# Altium project STM32unit.PrjPcb
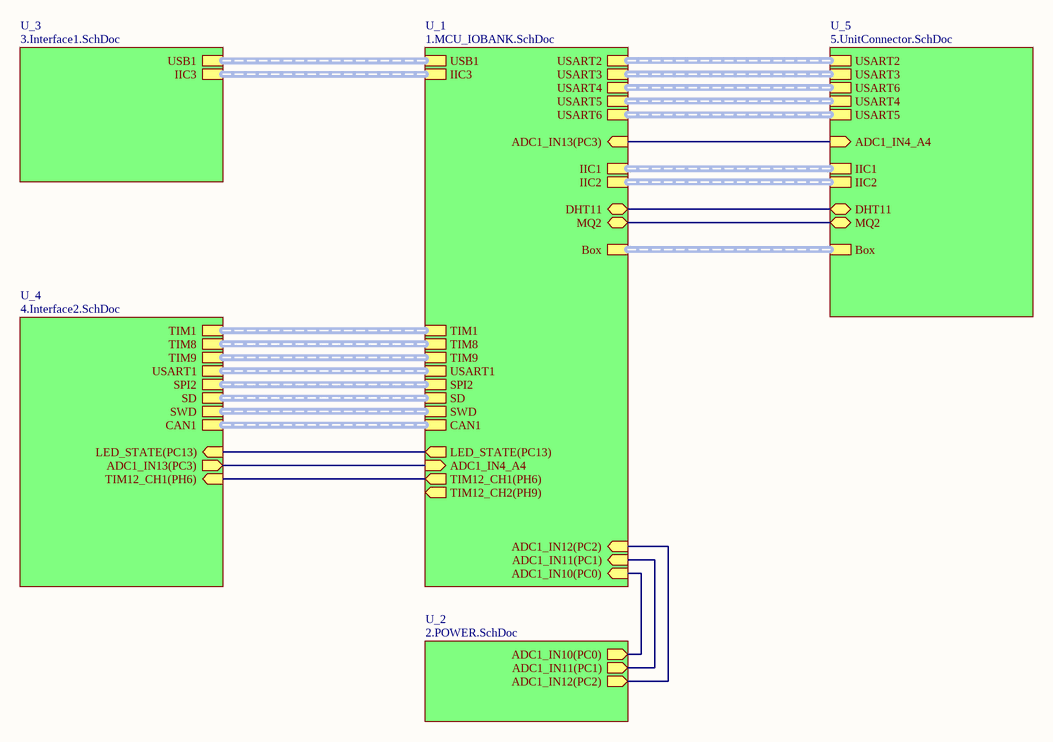
[diagram p0: SCH_Connect.SchDoc]
6 sheets, 230 parts. Net scope: hierarchical (ports join the sheet entries above them; power ports are global).
Board file: STM32unitV1.PcbDoc
Sheets:
  SCH_Connect.SchDoc
    U_1 = 1.MCU_IOBANK.SchDoc
    U_2 = 2.POWER.SchDoc
    U_3 = 3.Interface1.SchDoc
    U_4 = 4.Interface2.SchDoc
    U_5 = 5.UnitConnector.SchDoc

## Sheet SCH_Connect.SchDoc
size A4; DocumentNumber: 1; SheetNumber: 1; SheetTotal: 6

### Sub-sheets
U_1 = 1.MCU_IOBANK.SchDoc: TIM12_CH1(PH6) (out), TIM12_CH2(PH9) (out), LED_STATE(PC13) (out), ADC1_IN10(PC0) (in), ADC1_IN11(PC1) (in), ADC1_IN12(PC2) (in), ADC1_IN13(PC3) (in), TIM1 (harness TIM1), TIM8 (harness TIM8), USART1 (harness USART1), TIM9 (harness TIM9), SPI2 (harness SPI2), SD (harness SD), USART2 (harness USART2), USART3 (harness USART3), USART6 (harness USART6), SWD (harness SWD), CAN1 (harness CAN1), USB1 (harness USB1), ADC1_IN4_A4 (in), USART4 (harness USART4), USART5 (harness USART5), IIC1 (harness IIC1), IIC2 (harness IIC2), DHT11 (bidir), MQ2 (bidir), IIC3 (harness IIC3), Box (harness Box)
U_2 = 2.POWER.SchDoc: ADC1_IN10(PC0) (out), ADC1_IN11(PC1) (out), ADC1_IN12(PC2) (out)
U_3 = 3.Interface1.SchDoc: USB1 (harness USB1), IIC3 (harness IIC3)
U_4 = 4.Interface2.SchDoc: TIM12_CH1(PH6) (in), ADC1_IN13(PC3) (out), TIM1 (harness TIM1), TIM8 (harness TIM8), USART1 (harness USART1), TIM9 (harness TIM9), SPI2 (harness SPI2), LED_STATE(PC13) (in), SD (harness SD), SWD (harness SWD), CAN1 (harness CAN1)
U_5 = 5.UnitConnector.SchDoc: USART2 (harness USART2), USART3 (harness USART3), USART6 (harness USART6), ADC1_IN4_A4 (in), USART4 (harness USART4), USART5 (harness USART5), IIC1 (harness IIC1), IIC2 (harness IIC2), DHT11 (bidir), MQ2 (bidir), Box (harness Box)

### Nets
PA4: sheet U_1/ADC1_IN4_A4, sheet U_4/ADC1_IN13(PC3)
PC0: sheet U_1/ADC1_IN10(PC0), sheet U_2/ADC1_IN10(PC0)
PC1: sheet U_1/ADC1_IN11(PC1), sheet U_2/ADC1_IN11(PC1)
PC2: sheet U_1/ADC1_IN12(PC2), sheet U_2/ADC1_IN12(PC2)
PC3: sheet U_1/ADC1_IN13(PC3), sheet U_5/ADC1_IN4_A4
PC4: sheet U_1/DHT11, sheet U_5/DHT11
PC5: sheet U_1/MQ2, sheet U_5/MQ2
PC13: sheet U_1/LED_STATE(PC13), sheet U_4/LED_STATE(PC13)
PH6: sheet U_1/TIM12_CH1(PH6), sheet U_4/TIM12_CH1(PH6)

### Buses and harness runs
harness sheet U_1/Box = sheet U_5/Box
harness sheet U_1/CAN1 = sheet U_4/CAN1
harness sheet U_1/IIC1 = sheet U_5/IIC1
harness sheet U_1/IIC2 = sheet U_5/IIC2
harness sheet U_1/IIC3 = sheet U_3/IIC3
harness sheet U_1/SD = sheet U_4/SD
harness sheet U_1/SPI2 = sheet U_4/SPI2
harness sheet U_1/SWD = sheet U_4/SWD
harness sheet U_1/TIM1 = sheet U_4/TIM1
harness sheet U_1/TIM8 = sheet U_4/TIM8
harness sheet U_1/TIM9 = sheet U_4/TIM9
harness sheet U_1/USART1 = sheet U_4/USART1
harness sheet U_1/USART2 = sheet U_5/USART2
harness sheet U_1/USART3 = sheet U_5/USART3
harness sheet U_1/USART4 = sheet U_5/USART6
harness sheet U_1/USART5 = sheet U_5/USART4
harness sheet U_1/USART6 = sheet U_5/USART5
harness sheet U_1/USB1 = sheet U_3/USB1

## Sheet 1.MCU_IOBANK.SchDoc
size A3; DocumentNumber: 2; SheetNumber: 2; SheetTotal: 6
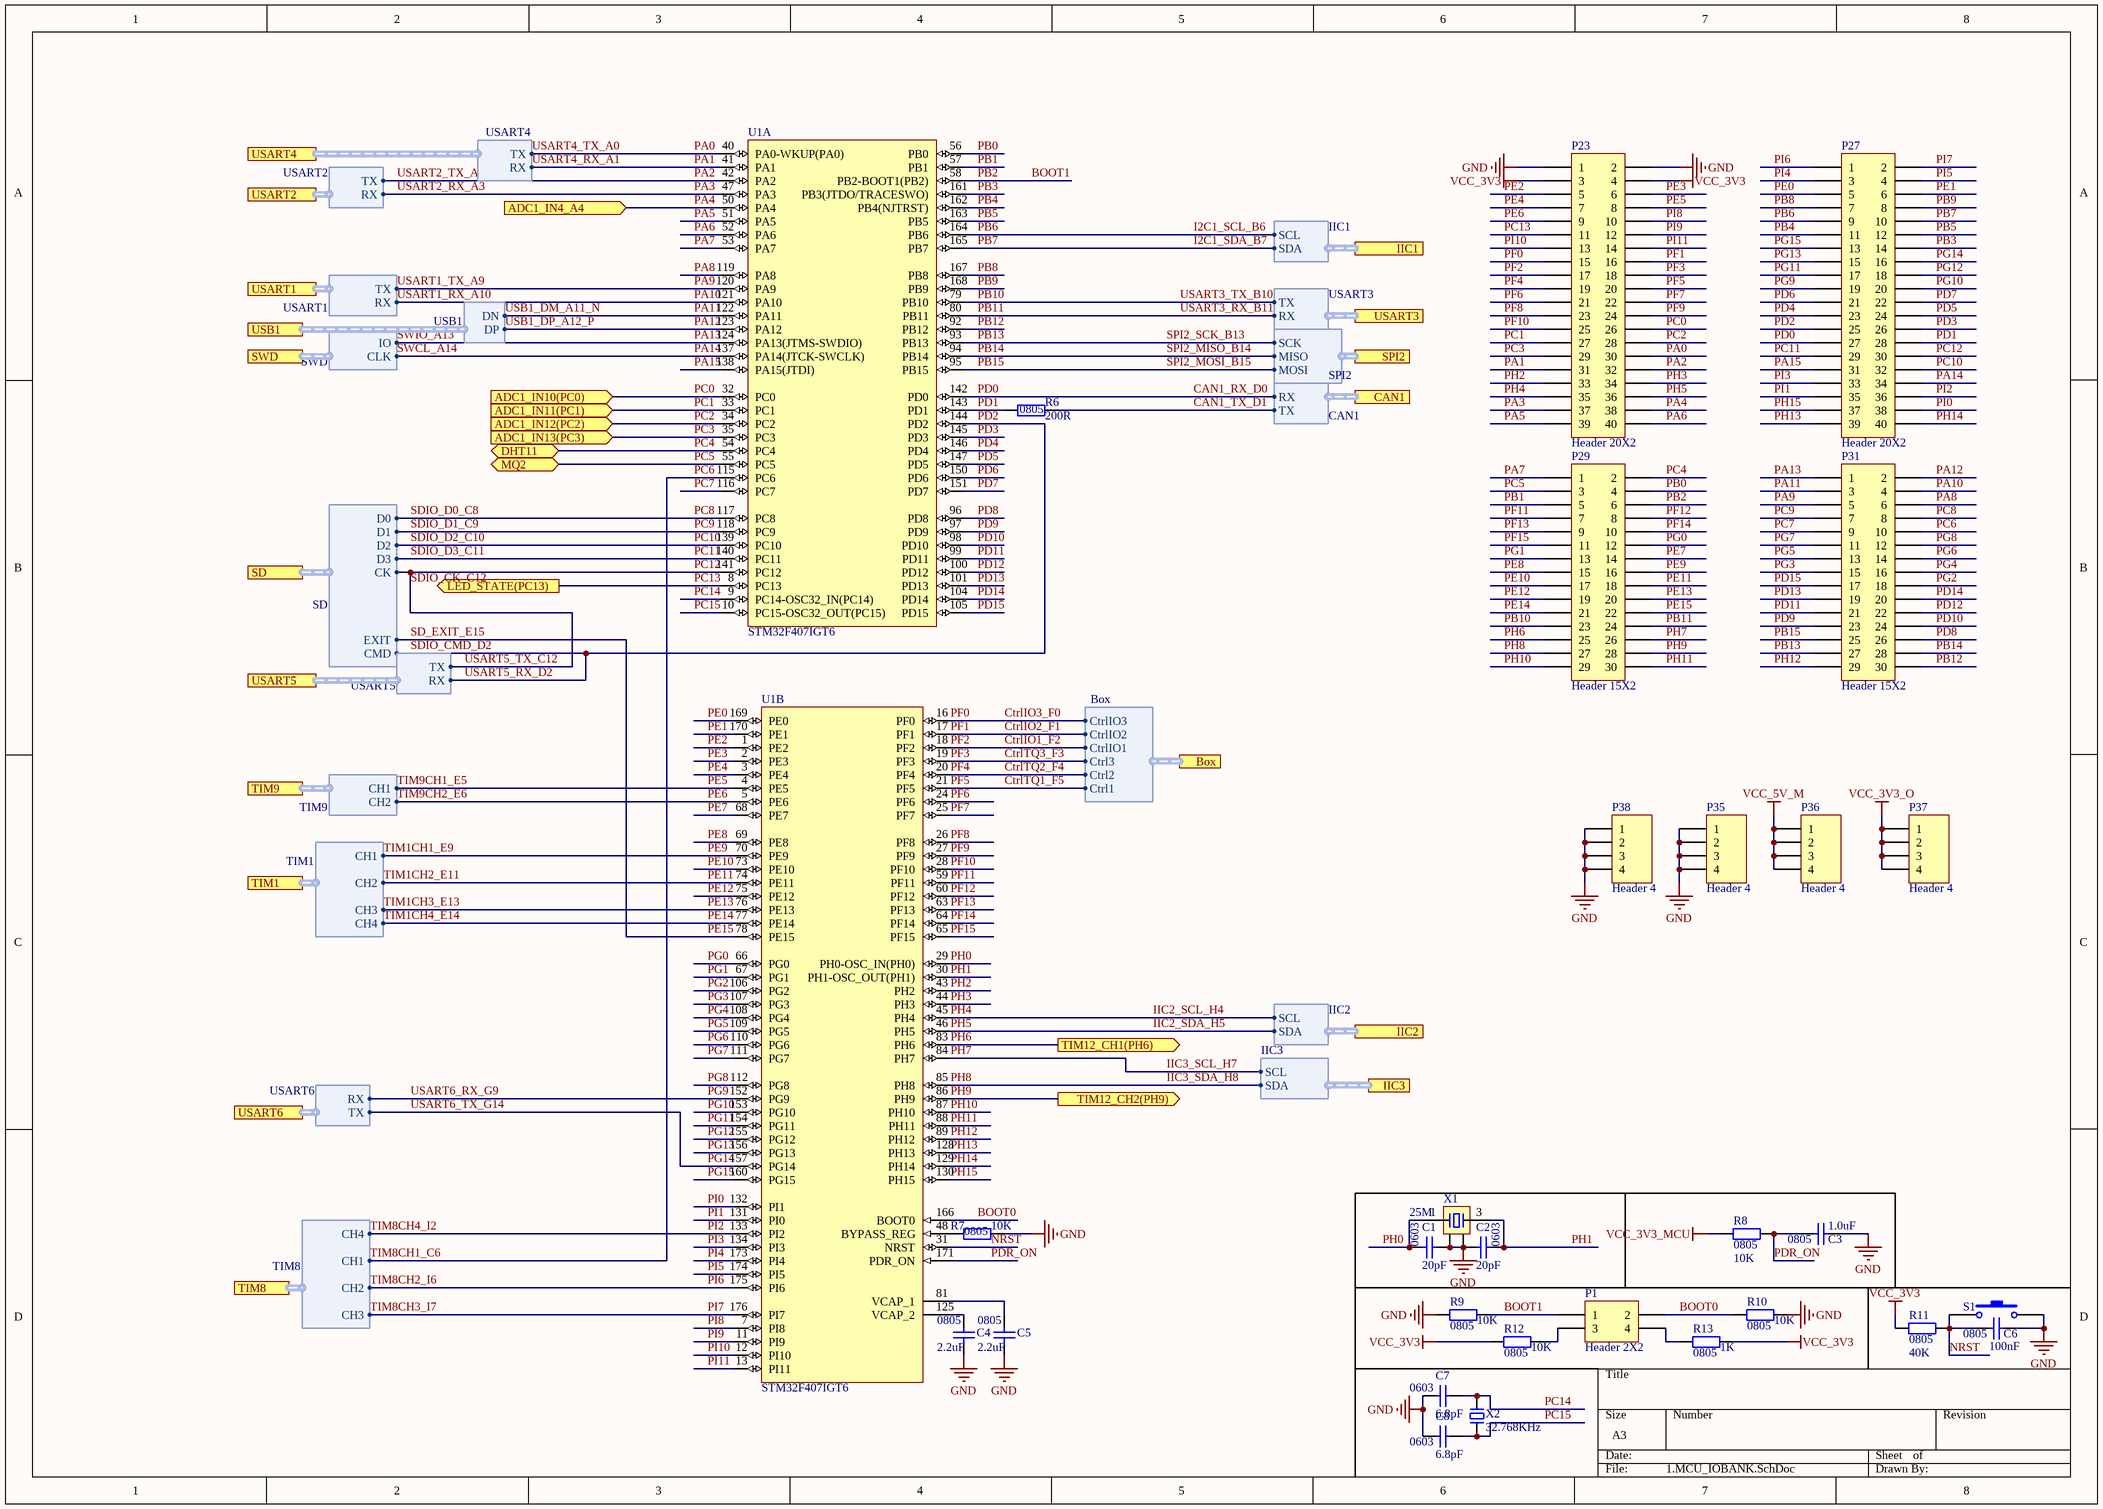
[diagram p1: 1.MCU_IOBANK.SchDoc]

### Parts
C1  0603  value 20pF  [C 0603_L]
C2  0603  value 20pF  [C 0603_L]
C3  0805  value 1.0uF  [C 0805_M]
C4  0805  value 2.2uF  [C 0805_M]
C5  0805  value 2.2uF  [C 0805_M]
C6  0805  value 100nF  [C 0805_M]
C7  0603  value 6.8pF  [C 0603_M]
C8  0603  value 6.8pF  [C 0603_L]
P1  Header 2X2  [HDR2.54-LI-2x2P]
P23  Header 20X2  [HDR2X20]
P27  Header 20X2  [HDR2X20]
P29  Header 15X2  [HDR2X15]
P31  Header 15X2  [HDR2X15]
P35  Header 4  [HDR2.54-LI-4P]
P36  Header 4  [HDR2.54-LI-4P]
P37  Header 4  [HDR2.54-LI-4P]
P38  Header 4  [HDR2.54-LI-4P]
R6  0805  value 200R  [R 0805_L]
R7  0805  value 10K  [R 0805_L]
R8  0805  value 10K  [R 0805_L]
R9  0805  value 10K  [R 0805_L]
R10  0805  value 10K  [R 0805_L]
R11  0805  value 40K  [R 0805_L]
R12  0805  value 10K  [R 0805_L]
R13  0805  value 1K  [R 0805_L]
S1  SW  [TSW DIP-3*6*5]  (value not drawn)
U1  STM32F407IGT6  [STM-LQFP176_N]  (parts A,B of 3)
X1  25M  [XTAL-3225]
X2  32.768KHz  [XTAL-3215A]

### Ports
ADC1_IN4_A4 (in), ADC1_IN10(PC0) (in), ADC1_IN11(PC1) (in), ADC1_IN12(PC2) (in), ADC1_IN13(PC3) (in), Box (harness Box), CAN1 (harness CAN1), DHT11 (bidir), IIC1 (harness IIC1), IIC2 (harness IIC2), IIC3 (harness IIC3), LED_STATE(PC13) (out), MQ2 (bidir), SD (harness SD), SPI2 (harness SPI2), SWD (harness SWD), TIM1 (harness TIM1), TIM8 (harness TIM8), TIM9 (harness TIM9), TIM12_CH1(PH6) (out), TIM12_CH2(PH9) (out), USART1 (harness USART1), USART2 (harness USART2), USART3 (harness USART3), USART4 (harness USART4), USART5 (harness USART5), USART6 (harness USART6), USB1 (harness USB1)

### Harnesses
TIM1: CH1, CH2, CH3, CH4
TIM8: CH1, CH2, CH3, CH4
USART1: RX, TX
TIM9: CH1, CH2
SPI2: MOSI, MISO, SCK
SD: EXIT, D1, D0, CK, CMD, D3, D2
USART2: TX, RX
USART3: RX, TX
USART6: TX, RX
SWD: IO, CLK
CAN1: TX, RX
USB1: DN, DP
USART4: TX, RX
USART5: TX, RX
IIC1: SCL, SDA
IIC2: SCL, SDA
IIC3: SDA, SCL
Box: Ctrl1, Ctrl2, Ctrl3, CtrlIO1, CtrlIO2, CtrlIO3

### Nets
GND: C1.2 C2.1 C3.1 C4.1 C5.1 C6.1 C7.1 C8.1 P23.1 P23.2 P35.1 P35.2 P35.3 P35.4 P38.1 P38.2 P38.3 P38.4 R7.2 R9.1 R10.2 S1.2 X1.2 X1.4
VCC_3V3: P23.3 P23.4 R11.1 R12.1 R13.2  [project net +3.3V]
VCC_3V3_MCU: R8.1
VCC_3V3_O: P37.1 P37.2 P37.3 P37.4
VCC_5V_M: P36.1 P36.2 P36.3 P36.4
BOOT0: P1.2 R10.1 U1.166(BOOT0)
BOOT1: P1.1 P29.6 R9.2 U1.58(PB2-BOOT1(PB2))  [also labelled PB2]
CAN1_RX_D0: P27.27 U1.142(PD0) ; port CAN1.RX  [also labelled PD0]
CAN1_TX_D1: R6.2 ; port CAN1.TX
CtrlIO1_F2: P23.17 U1.18(PF2) ; port Box.CtrlIO1  [also labelled PF2]
CtrlIO2_F1: P23.16 U1.17(PF1) ; port Box.CtrlIO2  [also labelled PF1]
CtrlIO3_F0: P23.15 U1.16(PF0) ; port Box.CtrlIO3  [also labelled PF0]
CtrlTQ1_F5: P23.20 U1.21(PF5) ; port Box.Ctrl1  [also labelled PF5]
CtrlTQ2_F4: P23.19 U1.20(PF4) ; port Box.Ctrl2  [also labelled PF4]
CtrlTQ3_F3: P23.18 U1.19(PF3) ; port Box.Ctrl3  [also labelled PF3]
I2C1_SCL_B6: P27.9 U1.164(PB6) ; port IIC1.SCL  [also labelled PB6]
I2C1_SDA_B7: P27.10 U1.165(PB7) ; port IIC1.SDA  [also labelled PB7]
IIC2_SCL_H4: P23.35 U1.45(PH4) ; port IIC2.SCL  [also labelled PH4]
IIC2_SDA_H5: P23.36 U1.46(PH5) ; port IIC2.SDA  [also labelled PH5]
IIC3_SCL_H7: P29.26 U1.84(PH7) ; port IIC3.SCL  [also labelled PH7]
IIC3_SDA_H8: P29.27 U1.85(PH8) ; port IIC3.SDA  [also labelled PH8]
NRST: C6.2 R11.2 S1.1 U1.31(NRST)
PA0: P23.30 U1.40(PA0-WKUP(PA0)) ; port USART4.TX  [also labelled USART4_TX_A0]
PA1: P23.31 U1.41(PA1) ; port USART4.RX  [also labelled USART4_RX_A1]
PA2: P23.32 U1.42(PA2) ; port USART2.TX  [also labelled USART2_TX_A2]
PA3: P23.37 U1.47(PA3) ; port USART2.RX  [also labelled USART2_RX_A3]
PA4: P23.38 U1.50(PA4) ; port ADC1_IN4_A4
PA5: P23.39 U1.51(PA5)
PA6: P23.40 U1.52(PA6)
PA7: P29.1 U1.53(PA7)
PA8: P31.6 U1.119(PA8)
PA9: P31.5 U1.120(PA9) ; port USART1.TX  [also labelled USART1_TX_A9]
PA10: P31.4 U1.121(PA10) ; port USART1.RX  [also labelled USART1_RX_A10]
PA11: P31.3 U1.122(PA11) ; port USB1.DN  [also labelled USB1_DM_A11_N]
PA12: P31.2 U1.123(PA12) ; port USB1.DP  [also labelled USB1_DP_A12_P]
PA13: P31.1 U1.124(PA13(JTMS-SWDIO)) ; port SWD.IO  [also labelled SWIO_A13]
PA14: P27.34 U1.137(PA14(JTCK-SWCLK)) ; port SWD.CLK  [also labelled SWCL_A14]
PA15: P27.31 U1.138(PA15(JTDI))
PB0: P29.4 U1.56(PB0)
PB1: P29.5 U1.57(PB1)
PB3: P27.14 U1.161(PB3(JTDO/TRACESWO))
PB4: P27.11 U1.162(PB4(NJTRST))
PB5: P27.12 U1.163(PB5)
PB8: P27.7 U1.167(PB8)
PB9: P27.8 U1.168(PB9)
PB10: P29.23 U1.79(PB10) ; port USART3.TX  [also labelled USART3_TX_B10]
PB11: P29.24 U1.80(PB11) ; port USART3.RX  [also labelled USART3_RX_B11]
PB12: P31.30 U1.92(PB12)
PB13: P31.27 U1.93(PB13) ; port SPI2.SCK  [also labelled SPI2_SCK_B13]
PB14: P31.28 U1.94(PB14) ; port SPI2.MISO  [also labelled SPI2_MISO_B14]
PB15: P31.25 U1.95(PB15) ; port SPI2.MOSI  [also labelled SPI2_MOSI_B15]
PC0: P23.26 U1.32(PC0) ; port ADC1_IN10(PC0)
PC1: P23.27 U1.33(PC1) ; port ADC1_IN11(PC1)
PC2: P23.28 U1.34(PC2) ; port ADC1_IN12(PC2)
PC3: P23.29 U1.35(PC3) ; port ADC1_IN13(PC3)
PC4: P29.2 U1.54(PC4) ; port DHT11
PC5: P29.3 U1.55(PC5) ; port MQ2
PC6: P31.10 U1.115(PC6) ; port TIM8.CH1  [also labelled TIM8CH1_C6]
PC7: P31.9 U1.116(PC7)
PC8: P31.8 U1.117(PC8) ; port SD.D0  [also labelled SDIO_D0_C8]
PC9: P31.7 U1.118(PC9) ; port SD.D1  [also labelled SDIO_D1_C9]
PC10: P27.32 U1.139(PC10) ; port SD.D2  [also labelled SDIO_D2_C10]
PC11: P27.29 U1.140(PC11) ; port SD.D3  [also labelled SDIO_D3_C11]
PC12: P27.30 U1.141(PC12) ; port SD.CK, port USART5.TX  [also labelled SDIO_CK_C12, USART5_TX_C12]
PC13: P23.11 U1.8(PC13) ; port LED_STATE(PC13)
PC14: C7.2 U1.9(PC14-OSC32_IN(PC14)) X2.2
PC15: C8.2 U1.10(PC15-OSC32_OUT(PC15)) X2.1
PD1: P27.28 R6.1 U1.143(PD1)
PD2: P27.25 U1.144(PD2) ; port SD.CMD, port USART5.RX  [also labelled SDIO_CMD_D2, USART5_RX_D2]
PD3: P27.26 U1.145(PD3)
PD4: P27.23 U1.146(PD4)
PD5: P27.24 U1.147(PD5)
PD6: P27.21 U1.150(PD6)
PD7: P27.22 U1.151(PD7)
PD8: P31.26 U1.96(PD8)
PD9: P31.23 U1.97(PD9)
PD10: P31.24 U1.98(PD10)
PD11: P31.21 U1.99(PD11)
PD12: P31.22 U1.100(PD12)
PD13: P31.19 U1.101(PD13)
PD14: P31.20 U1.104(PD14)
PD15: P31.17 U1.105(PD15)
PDR_ON: C3.2 R8.2 U1.171(PDR_ON)
PE0: P27.5 U1.169(PE0)
PE1: P27.6 U1.170(PE1)
PE2: P23.5 U1.1(PE2)
PE3: P23.6 U1.2(PE3)
PE4: P23.7 U1.3(PE4)
PE5: P23.8 U1.4(PE5) ; port TIM9.CH1  [also labelled TIM9CH1_E5]
PE6: P23.9 U1.5(PE6) ; port TIM9.CH2  [also labelled TIM9CH2_E6]
PE7: P29.14 U1.68(PE7)
PE8: P29.15 U1.69(PE8)
PE9: P29.16 U1.70(PE9) ; port TIM1.CH1  [also labelled TIM1CH1_E9]
PE10: P29.17 U1.73(PE10)
PE11: P29.18 U1.74(PE11) ; port TIM1.CH2  [also labelled TIM1CH2_E11]
PE12: P29.19 U1.75(PE12)
PE13: P29.20 U1.76(PE13) ; port TIM1.CH3  [also labelled TIM1CH3_E13]
PE14: P29.21 U1.77(PE14) ; port TIM1.CH4  [also labelled TIM1CH4_E14]
PE15: P29.22 U1.78(PE15) ; port SD.EXIT  [also labelled SD_EXIT_E15]
PF6: P23.21 U1.24(PF6)
PF7: P23.22 U1.25(PF7)
PF8: P23.23 U1.26(PF8)
PF9: P23.24 U1.27(PF9)
PF10: P23.25 U1.28(PF10)
PF11: P29.7 U1.59(PF11)
PF12: P29.8 U1.60(PF12)
PF13: P29.9 U1.63(PF13)
PF14: P29.10 U1.64(PF14)
PF15: P29.11 U1.65(PF15)
PG0: P29.12 U1.66(PG0)
PG1: P29.13 U1.67(PG1)
PG2: P31.18 U1.106(PG2)
PG3: P31.15 U1.107(PG3)
PG4: P31.16 U1.108(PG4)
PG5: P31.13 U1.109(PG5)
PG6: P31.14 U1.110(PG6)
PG7: P31.11 U1.111(PG7)
PG8: P31.12 U1.112(PG8)
PG9: P27.19 U1.152(PG9) ; port USART6.RX  [also labelled USART6_RX_G9]
PG10: P27.20 U1.153(PG10)
PG11: P27.17 U1.154(PG11)
PG12: P27.18 U1.155(PG12)
PG13: P27.15 U1.156(PG13)
PG14: P27.16 U1.157(PG14) ; port USART6.TX  [also labelled USART6_TX_G14]
PG15: P27.13 U1.160(PG15)
PH0: C1.1 U1.29(PH0-OSC_IN(PH0)) X1.1
PH1: C2.2 U1.30(PH1-OSC_OUT(PH1)) X1.3
PH2: P23.33 U1.43(PH2)
PH3: P23.34 U1.44(PH3)
PH6: P29.25 U1.83(PH6) ; port TIM12_CH1(PH6)
PH9: P29.28 U1.86(PH9) ; port TIM12_CH2(PH9)
PH10: P29.29 U1.87(PH10)
PH11: P29.30 U1.88(PH11)
PH12: P31.29 U1.89(PH12)
PH13: P27.39 U1.128(PH13)
PH14: P27.40 U1.129(PH14)
PH15: P27.37 U1.130(PH15)
PI0: P27.38 U1.132(PI1)
PI1: P27.35 U1.131(PI0)
PI2: P27.36 U1.133(PI2) ; port TIM8.CH4  [also labelled TIM8CH4_I2]
PI3: P27.33 U1.134(PI3)
PI4: P27.3 U1.173(PI4)
PI5: P27.4 U1.174(PI5)
PI6: P27.1 U1.175(PI6) ; port TIM8.CH2  [also labelled TIM8CH2_I6]
PI7: P27.2 U1.176(PI7) ; port TIM8.CH3  [also labelled TIM8CH3_I7]
PI8: P23.10 U1.7(PI8)
PI9: P23.12 U1.11(PI9)
PI10: P23.13 U1.12(PI10)
PI11: P23.14 U1.13(PI11)
NetC4_2: C4.2 U1.125(VCAP_2)
NetC5_2: C5.2 U1.81(VCAP_1)
NetP1_3: P1.3 R12.2
NetP1_4: P1.4 R13.1
NetR7_1: R7.1 U1.48(BYPASS_REG)

### Library data of the parts
C1-C8 = CAP
P1 = Header 2X2: Header, 2-Pin, Dual row; LatestRevisionDate: 17-Jul-2002; LatestRevisionNote: Re-released for DXP Platform.; Publisher: Altium Limited
P23 P27 = Header 20X2: Header, 20-Pin, Dual row; LatestRevisionDate: 17-Jul-2002; LatestRevisionNote: Re-released for DXP Platform.; Publisher: Altium Limited
P29 P31 = Header 15X2: Header, 15-Pin, Dual row; LatestRevisionDate: 17-Jul-2002; LatestRevisionNote: Re-released for DXP Platform.; Publisher: Altium Limited
P35-P38 = Header 4: Header, 4-Pin; LatestRevisionDate: 17-Jul-2002; LatestRevisionNote: Re-released for DXP Platform.; Publisher: Altium Limited
R6-R13 = RES2: Resistor; Published: 8-Jun-2000; LatestRevisionDate: 17-Jul-2002; LatestRevisionNote: Re-released for DXP Platform.; PackageReference: AXIAL-0.3; Publisher: Altium Limited; PackageDescription: Axial Device, Thru-Hole; 2 Leads; 0.3 in Pin Spacing
U1 = STM32F407IGT6: ARM Cortex-M4 32-bit MCU+FPU, 210 DMIPS, 1024 kB Flash, 192 kB Internal RAM, 140 I/Os, 176-pin LQFP, -40 to 85 degC, Tray; Manufacturer: STMicroelectronics; D/A Converter: 2x12-bit; FLASH Size (Prog) (kB): 1024; I/Os (High Current): 140; Internal RAM Size (kB): 192; Operating Frequency(F) (Processor speed) (MHz): 168; Supply Voltage(Vcc) max (V): 3.6; Supply Voltage(Vcc) min (V): 1.8; DatasheetVersion: Rev. 4; PackageVersion: Rev. 4, 06/2013; PackageReference: LQFP176; PackageDescription: 176-Pin Low Profile Quad Flat Package, 24 x 24 mm Body, 0.5 mm Pitch; Supplier 1: Digi-Key; Supplier Part Number 1: 497-11604-ND; Supplier 2: Farnell; Supplier Part Number 2: 2064366; Supplier 3: Newark; Supplier Part Number 3: 73T2331; Supplier 4: Mouser; Supplier Part Number 4: 511-STM32F407IGT6; Core: ARM Cortex-M4; Packing: Tray; Mounting Technology: Surface Mount; PartNumber: STM32F407IGT6; ComponentLink1Description: Manufacturer URL; ComponentLink1URL: http://www.st.com/web/en/home.html; ComponentLink2Description: Datasheet; ComponentLink2URL: http://www.st.com/st-web-ui/static/active/en/resource/technical/document/datasheet/DM00037051.pdf; ComponentLink3Description: Package Specification; ComponentLink3URL: http://www.st.com/st-web-ui/static/active/en/resource/technical/document/datasheet/DM00035129.pdf
X1 = XTAL-4: 4脚晶振; 版权归属: 源创客; BOM名称: 4脚晶振; 学习资源: www.ooocke.com
X2 = XTAL-2: 2脚晶振; 版权归属: 源创客; BOM名称: 2脚晶振; 学习资源: www.ooocke.com
S1 = SW: Published: 24-Mar-1999; LatestRevisionDate: 17-Jul-2002; LatestRevisionNote: Re-released for DXP Platform.; Publisher: Altium Limited

## Sheet 2.POWER.SchDoc
size A4; DocumentNumber: 3; SheetNumber: 3; SheetTotal: 6
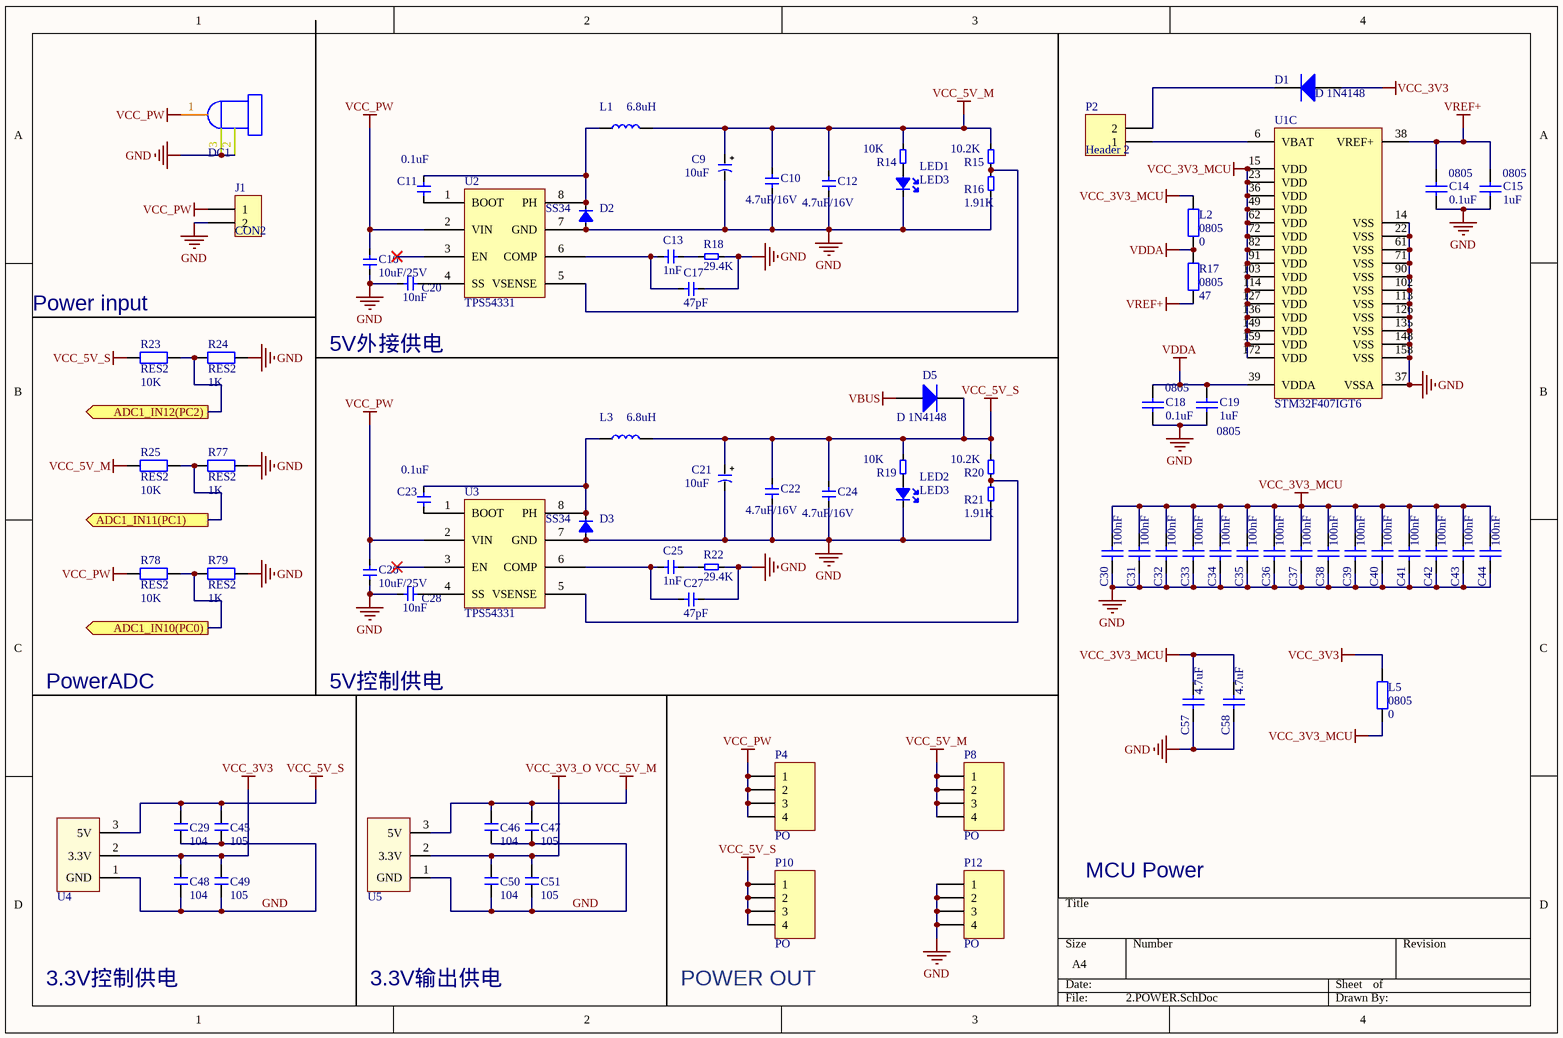
[diagram p2: 2.POWER.SchDoc]

### Parts
C9  10uF  [3528]
C10  4.7uF/16V  [0603C]
C11  0.1uF  [0603C]
C12  4.7uF/16V  [0603C]
C13  1nF  [0603C]
C14  0805  value 0.1uF  [C 0603_L]
C15  0805  value 1uF  [C 0603_L]
C16  10uF/25V  [1206]
C17  47pF  [0603C]
C18  0805  value 0.1uF  [C 0603_L]
C19  0805  value 1uF  [C 0603_L]
C20  10nF  [0603C]
C21  10uF  [3528]
C22  4.7uF/16V  [0603C]
C23  0.1uF  [0603C]
C24  4.7uF/16V  [0603C]
C25  1nF  [0603C]
C26  10uF/25V  [1206]
C27  47pF  [0603C]
C28  10nF  [0603C]
C29  104  [C 0805]
C30  value 100nF  [C 0603_L]  (hidden comment: 0805)
C31  value 100nF  [C 0603_L]  (hidden comment: 0805)
C32  value 100nF  [C 0603_L]  (hidden comment: 0805)
C33  value 100nF  [C 0603_L]  (hidden comment: 0805)
C34  value 100nF  [C 0603_L]  (hidden comment: 0805)
C35  value 100nF  [C 0603_L]  (hidden comment: 0805)
C36  value 100nF  [C 0603_L]  (hidden comment: 0805)
C37  value 100nF  [C 0603_L]  (hidden comment: 0805)
C38  value 100nF  [C 0603_L]  (hidden comment: 0805)
C39  value 100nF  [C 0603_L]  (hidden comment: 0805)
C40  value 100nF  [C 0603_L]  (hidden comment: 0805)
C41  value 100nF  [C 0603_L]  (hidden comment: 0805)
C42  value 100nF  [C 0603_L]  (hidden comment: 0805)
C43  value 100nF  [C 0603_L]  (hidden comment: 0805)
C44  value 100nF  [C 0603_L]  (hidden comment: 0805)
C45  105  [C 0805]
C46  104  [C 0805]
C47  105  [C 0805]
C48  104  [C 0805]
C49  105  [C 0805]
C50  104  [C 0805]
C51  105  [C 0805]
C57  value 4.7uF  [C 0805_M]  (hidden comment: 0805)
C58  value 4.7uF  [C 0805_M]  (hidden comment: 0805)
D1  D 1N4148  [SOD-523]
D2  SS34  [DO-214AC-SMA]
D3  SS34  [DO-214AC-SMA]
D5  D 1N4148  [SOD-123]
DC1  DC  [DC-005]  (value not drawn)
J1  CON2  [DG1282-5.0]
L1  6.8uH  [L100]
L2  0805  value 0  [R 0402_L]
L3  6.8uH  [L100]
L5  0805  value 0  [R 0805_L]
LED1  LED3  [0603-led]
LED2  LED3  [0603-led]
P2  Header 2  [HDR2.54-LI-2P]
P4  PO  [KF2EDGK-2.54-WI-4P]
P8  PO  [KF2EDGK-2.54-WI-4P]
P10  PO  [KF2EDGK-2.54-WI-4P]
P12  PO  [KF2EDGK-2.54-WI-4P]
R14  10K  [0603]
R15  10.2K  [0603]
R16  1.91K  [0603]
R17  0805  value 47  [R 0402_L]
R18  29.4K  [0603]
R19  10K  [0603]
R20  10.2K  [0603]
R21  1.91K  [0603]
R22  29.4K  [0603]
R23  RES2  value 10K  [R 0805_L]
R24  RES2  value 1K  [R 0805_L]
R25  RES2  value 10K  [R 0805_L]
R77  RES2  value 1K  [R 0805_L]
R78  RES2  value 10K  [R 0805_L]
R79  RES2  value 1K  [R 0805_L]
U1  STM32F407IGT6  [STM-LQFP176_N]  (part C of 3)
U2  TPS54331  [SO08]
U3  TPS54331  [SO08]
U4  LM1117  [SOT223]  (value not drawn)
U5  LM1117  [SOT223]  (value not drawn)

### Ports
ADC1_IN10(PC0) (out), ADC1_IN11(PC1) (out), ADC1_IN12(PC2) (out)

### Nets
GND: C9.2 C10.1 C12.1 C14.1 C15.1 C16.1 C17.2 C18.1 C19.1 C20.2 C21.2 C22.1 C24.1 C26.1 C27.2 C28.2 C29.1 C30.1 C31.1 C32.1 C33.1 C34.1 C35.1 C36.1 C37.1 C38.1 C39.1 C40.1 C41.1 C42.1 C43.1 C44.1 C45.2 C46.1 C47.2 C48.1 C49.2 C50.1 C51.2 C57.1 C58.1 D2.1(A) D3.1(A) DC1.2(-) DC1.3(-) J1.2 LED1.2(K) LED2.2(K) P12.1 P12.2 P12.3 P12.4 R16.1 R18.1 R21.1 R22.1 R24.1 R77.1 R79.1 U1.14(VSS) U1.22(VSS) U1.37(VSSA) U1.61(VSS) U1.71(VSS) U1.90(VSS) U1.102(VSS) U1.113(VSS) U1.126(VSS) U1.135(VSS) U1.148(VSS) U1.158(VSS) U2.7(GND) U3.7(GND) U4.1(GND) U5.1(GND)
VBUS: D5.1(A)
VCC_3V3: C48.2 C49.1 D1.1(A) L5.2 U4.2(3.3V)  [project net +3.3V]
VCC_3V3_MCU: C30.2 C31.2 C32.2 C33.2 C34.2 C35.2 C36.2 C37.2 C38.2 C39.2 C40.2 C41.2 C42.2 C43.2 C44.2 C57.2 C58.2 L2.2 L5.1 U1.15(VDD) U1.23(VDD) U1.36(VDD) U1.49(VDD) U1.62(VDD) U1.72(VDD) U1.82(VDD) U1.91(VDD) U1.103(VDD) U1.114(VDD) U1.127(VDD) U1.136(VDD) U1.149(VDD) U1.159(VDD) U1.172(VDD)
VCC_3V3_O: C50.2 C51.1 U5.2(3.3V)
VCC_5V_M: C9.1 C10.2 C12.2 C46.2 C47.1 L1.1 P8.1 P8.2 P8.3 P8.4 R14.2 R15.2 R25.2 U5.3(5V)
VCC_5V_S: C21.1 C22.2 C24.2 C29.2 C45.1 D5.2(K) L3.1 P10.1 P10.2 P10.3 P10.4 R19.2 R20.2 R23.2 U4.3(5V)
VCC_PW: C16.2 C26.2 DC1.1(+) J1.1 P4.1 P4.2 P4.3 P4.4 R78.2 U2.2(VIN) U3.2(VIN)
VDDA: C18.2 C19.2 L2.1 R17.2 U1.39(VDDA)
VREF+: C14.2 C15.2 R17.1 U1.38(VREF+)
PC0: R78.1 R79.2 ; port ADC1_IN10(PC0)
PC1: R25.1 R77.2 ; port ADC1_IN11(PC1)
PC2: R23.1 R24.2 ; port ADC1_IN12(PC2)
NetC11_1: C11.1 U2.1(BOOT)
NetC11_2: C11.2 D2.2(K) L1.2 U2.8(PH)
NetC13_1: C13.1 R18.2
NetC13_2: C13.2 C17.1 U2.6(COMP)
NetC20_1: C20.1 U2.4(SS)
NetC23_1: C23.1 U3.1(BOOT)
NetC23_2: C23.2 D3.2(K) L3.2 U3.8(PH)
NetC25_1: C25.1 R22.2
NetC25_2: C25.2 C27.1 U3.6(COMP)
NetC28_1: C28.1 U3.4(SS)
NetD1_2: D1.2(K) P2.2
NetLED1_1: LED1.1(A) R14.1
NetLED2_1: LED2.1(A) R19.1
NetP2_1: P2.1 U1.6(VBAT)
NetR15_1: R15.1 R16.2 U2.5(VSENSE)
NetR20_1: R20.1 R21.2 U3.5(VSENSE)

Not connected (* = marked no-connect by the designer): U2 3(EN)*; U3 3(EN)*

### Notes on the sheet
- (near R23) Power input
- 5V外接供电
- PowerADC
- 5V控制供电
- MCU Power
- 3.3V控制供电
- 3.3V输出供电
- (near P10) POWER OUT
- (in symbol CAP-+) +

### Library data of the parts
C9 C21 = CAP-+: Capacitor
C10 C12 C16 C17 C20 C22 C24 C26-C28 = CAP1: Capacitor
C11 C13 C23 C25 = CAP1: Capacitor; 类型: 电容
C14 C15 C18 C19 C30-C44 C57 C58 = CAP
C29 C45-C51 = C: 无极性贴片电容; 版权归属: 源创客; BOM名称: 无极性贴片电容; 学习资源: www.ooocke.com
D1 D5 = D 1N4148: High Conductance Fast Diode; Published: 8-Jun-2000; LatestRevisionDate: 17-Jul-2002; LatestRevisionNote: Re-released for DXP Platform.; DatasheetVersion: 1997; PackageReference: DO-35; Publisher: Altium Limited; PackageDescription: Diode, Axial; Body 3.8 x 1.9 mm (LxDia. max), Lead Dia. 0.53 mm (max); Code_JEDEC: DO-204-AH; ComponentLink1Description: Manufacturer Link; ComponentLink1URL: http://www.fairchildsemi.com/; ComponentLink2Description: Datasheet; ComponentLink2URL: http://www.fairchildsemi.com/ds/1N%2F1N4148.pdf
D2 D3 = DIOLED_1: DIODE LED
L1 L3 = INDUCTOR1_1
L2 L5 R17 R23-R25 R77-R79 = RES2: Resistor; Published: 8-Jun-2000; LatestRevisionDate: 17-Jul-2002; LatestRevisionNote: Re-released for DXP Platform.; PackageReference: AXIAL-0.3; Publisher: Altium Limited; PackageDescription: Axial Device, Thru-Hole; 2 Leads; 0.3 in Pin Spacing
LED1 LED2 = CP_DIOLED: DIODE LED
P2 = Header 2: Header, 2-Pin; LatestRevisionDate: 17-Jul-2002; LatestRevisionNote: Re-released for DXP Platform.; Publisher: Altium Limited
P4 P8 P10 P12 = Header 4: Header, 4-Pin; LatestRevisionDate: 17-Jul-2002; LatestRevisionNote: Re-released for DXP Platform.; Publisher: Altium Limited
R14-R16 R18-R22 = RES2
U1 = STM32F407IGT6: as U1 on sheet 1.MCU_IOBANK; DatasheetVersion: Rev. 4; PackageVersion: Rev. 4, 06/2013; PackageReference: LQFP176; PackageDescription: 176-Pin Low Profile Quad Flat Package, 24 x 24 mm Body, 0.5 mm Pitch; Supplier 1: Digi-Key; Supplier Part Number 1: 497-11604-ND; Supplier 2: Farnell; Supplier Part Number 2: 2064366; Supplier 3: Newark; Supplier Part Number 3: 73T2331; Supplier 4: Mouser; Supplier Part Number 4: 511-STM32F407IGT6; Core: ARM Cortex-M4; Packing: Tray; Mounting Technology: Surface Mount; PartNumber: STM32F407IGT6; ComponentLink1Description: Manufacturer URL; ComponentLink1URL: http://www.st.com/web/en/home.html; ComponentLink2Description: Datasheet; ComponentLink2URL: http://www.st.com/st-web-ui/static/active/en/resource/technical/document/datasheet/DM00037051.pdf; ComponentLink3Description: Package Specification; ComponentLink3URL: http://www.st.com/st-web-ui/static/active/en/resource/technical/document/datasheet/DM00035129.pdf

## Sheet 3.Interface1.SchDoc
size A4; DocumentNumber: 4; SheetNumber: 4; SheetTotal: 7
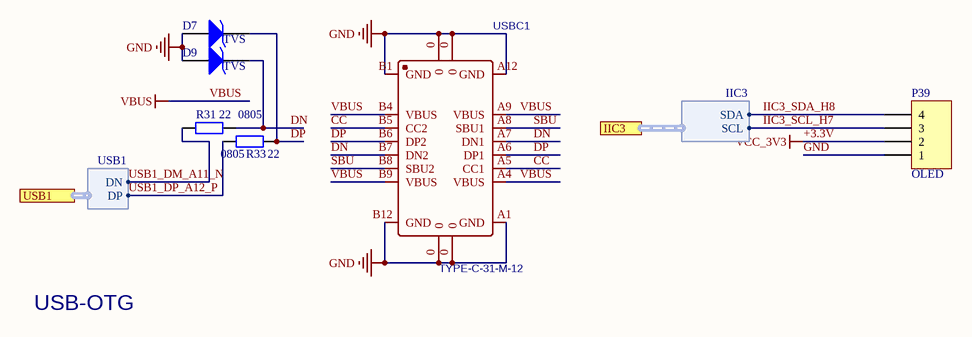
[diagram p3: 3.Interface1.SchDoc]

### Parts
D7  TVS  [SOD-523]
D9  TVS  [SOD-523]
P39  OLED  [HDR1X4]
R31  0805  value 22  [R 0805_L]
R33  0805  value 22  [R 0805_L]
USBC1  TYPE-C-31-M-12  [TYPE-C-USB-17]

### Ports
IIC3 (harness IIC3), USB1 (harness USB1)

### Harnesses
USB1: DN, DP
IIC3: SDA, SCL

### Nets
+3.3V: P39.2  [also labelled VCC_3V3]
GND: D7.1(A) D9.1(A) P39.1 USBC1.0 USBC1.A1(GND) USBC1.A12(GND) USBC1.B1(GND) USBC1.B12(GND)
VBUS: USBC1.A4(VBUS) USBC1.A9(VBUS) USBC1.B4(VBUS) USBC1.B9(VBUS)
CC: USBC1.A5(CC1) USBC1.B5(CC2)
DN: D9.2(K) R31.2 USBC1.A7(DN1) USBC1.B7(DN2)
DP: D7.2(K) R33.2 USBC1.A6(DP1) USBC1.B6(DP2)
IIC3_SCL_H7: P39.3 ; port IIC3.SCL
IIC3_SDA_H8: P39.4 ; port IIC3.SDA
SBU: USBC1.A8(SBU1) USBC1.B8(SBU2)
USB1_DM_A11_N: R31.1 ; port USB1.DN  [project net PA11]
USB1_DP_A12_P: R33.1 ; port USB1.DP  [project net PA12]

### Notes on the sheet
- USB-OTG

### Library data of the parts
D7 D9 = D: High Conductance Fast Diode; Published: 8-Jun-2000; LatestRevisionDate: 17-Jul-2002; LatestRevisionNote: Re-released for DXP Platform.; DatasheetVersion: 1997; PackageReference: DO-35; Publisher: Altium Limited; PackageDescription: Diode, Axial; Body 3.8 x 1.9 mm (LxDia. max), Lead Dia. 0.53 mm (max); Code_JEDEC: DO-204-AH; ComponentLink1Description: Manufacturer Link; ComponentLink1URL: http://www.fairchildsemi.com/; ComponentLink2Description: Datasheet; ComponentLink2URL: http://www.fairchildsemi.com/ds/1N%2F1N4148.pdf
P39 = Header 4: Header, 4-Pin; LatestRevisionDate: 17-Jul-2002; LatestRevisionNote: Re-released for DXP Platform.; Publisher: Altium Limited
R31 R33 = RES2: Resistor; Published: 8-Jun-2000; LatestRevisionDate: 17-Jul-2002; LatestRevisionNote: Re-released for DXP Platform.; PackageReference: AXIAL-0.3; Publisher: Altium Limited; PackageDescription: Axial Device, Thru-Hole; 2 Leads; 0.3 in Pin Spacing

## Sheet 4.Interface2.SchDoc
size A4; DocumentNumber: 5; SheetNumber: 5; SheetTotal: 6
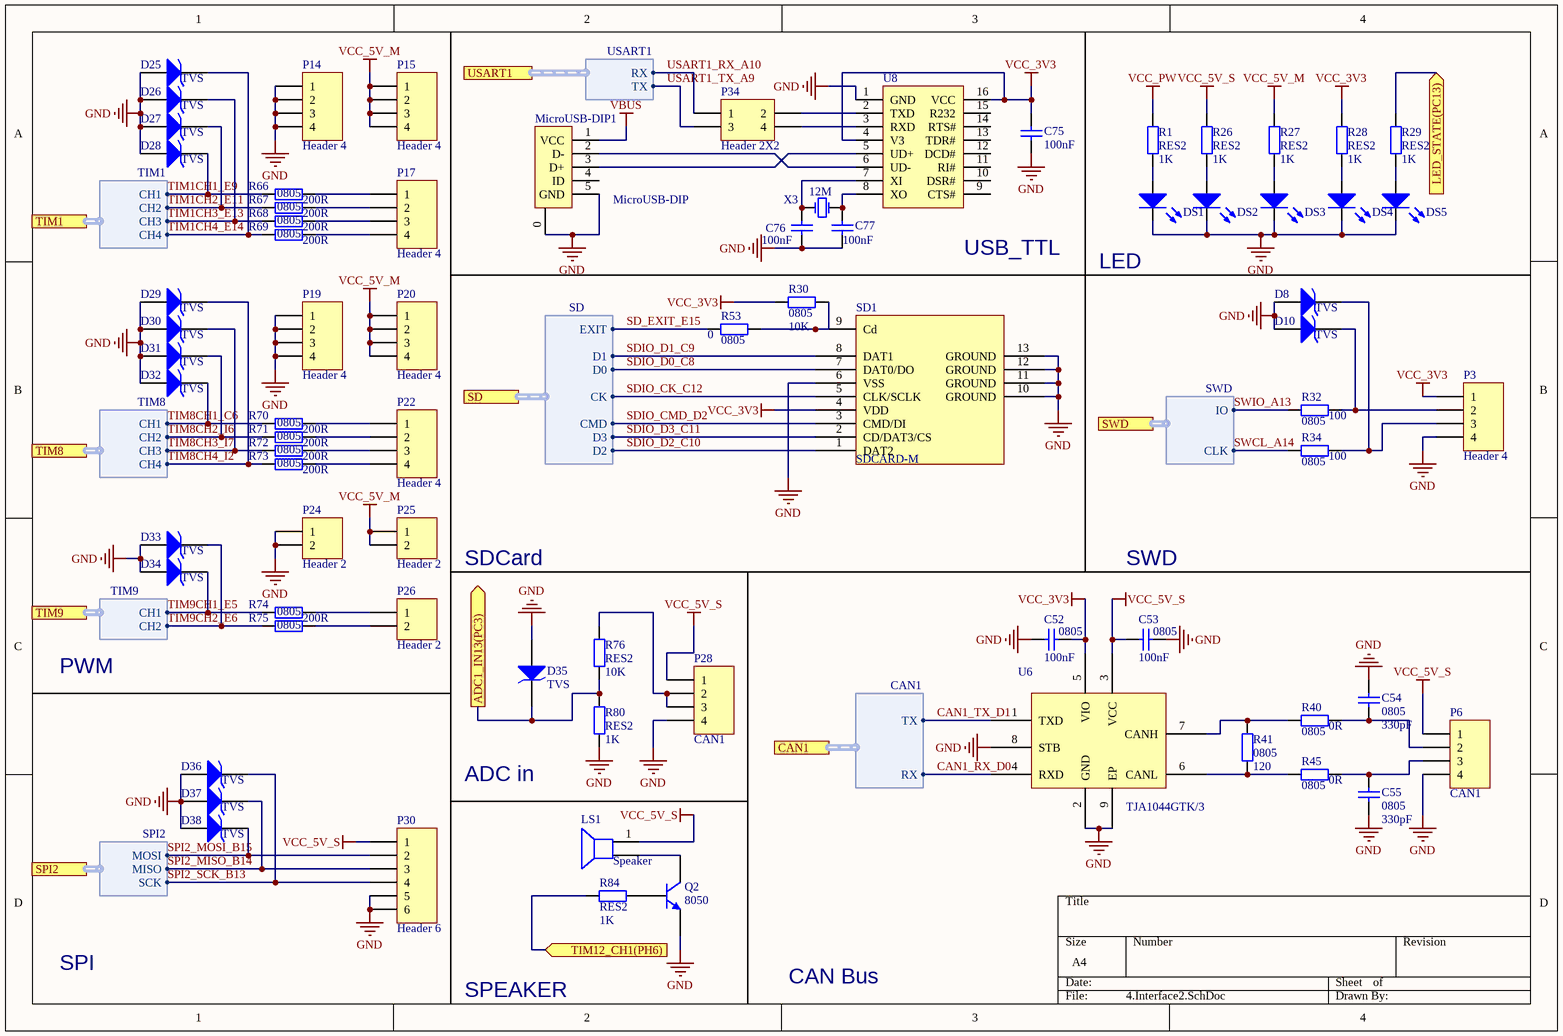
[diagram p4: 4.Interface2.SchDoc]

### Parts
C52  0805  value 100nF  [C 0805_M]
C53  0805  value 100nF  [C 0805_M]
C54  0805  value 330pF  [C 0805_M]
C55  0805  value 330pF  [C 0805_M]
C75  value 100nF  [C 0805_L]  (hidden comment: CAP)
C76  value 100nF  [C 0805_L]  (hidden comment: CAP)
C77  value 100nF  [C 0805_L]  (hidden comment: CAP)
D8  TVS  [SOD-523]
D10  TVS  [SOD-523]
D25  TVS  [SOD-523]
D26  TVS  [SOD-523]
D27  TVS  [SOD-523]
D28  TVS  [SOD-523]
D29  TVS  [SOD-523]
D30  TVS  [SOD-523]
D31  TVS  [SOD-523]
D32  TVS  [SOD-523]
D33  TVS  [SOD-523]
D34  TVS  [SOD-523]
D35  TVS  [SOD-523]
D36  TVS  [SOD-523]
D37  TVS  [SOD-523]
D38  TVS  [SOD-523]
DS1  LED  [LED 0805B]  (value not drawn)
DS2  LED  [LED 0805B]  (value not drawn)
DS3  LED  [LED 0805B]  (value not drawn)
DS4  LED  [LED 0805B]  (value not drawn)
DS5  LED  [LED 0805B]  (value not drawn)
LS1  Speaker  [BEEP 5x9x5.5]
MicroUSB-DIP1  MicroUSB-DIP  [MICRO_USB_DIP]
P3  Header 4  [KF2EDGK-2.54-WI-4P]
P6  CAN1  [KF2EDGK-2.54-WI-4P]
P14  Header 4  [HDR2.54-LI-4P]
P15  Header 4  [HDR2.54-LI-4P]
P17  Header 4  [HDR2.54-LI-4P]
P19  Header 4  [HDR2.54-LI-4P]
P20  Header 4  [HDR2.54-LI-4P]
P22  Header 4  [HDR2.54-LI-4P]
P24  Header 2  [HDR2.54-LI-2P]
P25  Header 2  [HDR2.54-LI-2P]
P26  Header 2  [HDR2.54-LI-2P]
P28  CAN1  [KF2EDGK-2.54-WI-4P]
P30  Header 6  [KF2EDGK-2.54-WI-6P]
P34  Header 2X2  [HDR2.54-LI-2x2P]
Q2  8050  [SOT23-3L]
R1  RES2  value 1K  [R 0805_L]
R26  RES2  value 1K  [R 0805_L]
R27  RES2  value 1K  [R 0805_L]
R28  RES2  value 1K  [R 0805_L]
R29  RES2  value 1K  [R 0805_L]
R30  0805  value 10K  [R 0805_L]
R32  0805  value 100  [R 0805_L]
R34  0805  value 100  [R 0805_L]
R40  0805  value 0R  [R 0805_L]
R41  0805  value 120  [R 0805_L]
R45  0805  value 0R  [R 0805_L]
R53  0805  value 0  [R 0805_L]
R66  0805  value 200R  [R 0805_L]
R67  0805  value 200R  [R 0805_L]
R68  0805  value 200R  [R 0805_L]
R69  0805  value 200R  [R 0805_L]
R70  0805  value 200R  [R 0805_L]
R71  0805  value 200R  [R 0805_L]
R72  0805  value 200R  [R 0805_L]
R73  0805  value 200R  [R 0805_L]
R74  0805  value 200R  [R 0805_L]
R75  0805  [R 0805_L]
R76  RES2  value 10K  [R 0805_L]
R80  RES2  value 1K  [R 0805_L]
R84  RES2  value 1K  [R 0805_L]
SD1  SDCARD-M  [SDCARD-M]
U6  TJA1044GTK/3  [HVSON8]
U8  CH340G  [SOP16_M]  (value not drawn)
X3  12M  [OSC HC-49S]

### Ports
ADC1_IN13(PC3) (out), CAN1 (harness CAN1), LED_STATE(PC13) (in), SD (harness SD), SPI2 (harness SPI2), SWD (harness SWD), TIM1 (harness TIM1), TIM8 (harness TIM8), TIM9 (harness TIM9), TIM12_CH1(PH6) (in), USART1 (harness USART1)

### Harnesses
TIM1: CH1, CH2, CH3, CH4
TIM8: CH1, CH2, CH3, CH4
USART1: RX, TX
TIM9: CH1, CH2
SPI2: MOSI, MISO, SCK
SD: EXIT, D1, D0, CK, CMD, D3, D2
SWD: IO, CLK
CAN1: TX, RX

### Nets
GND: C52.1 C53.2 C54.2 C55.1 C75.1 C76.1 C77.1 D8.1(A) D10.1(A) D25.1(A) D26.1(A) D27.1(A) D28.1(A) D29.1(A) D30.1(A) D31.1(A) D32.1(A) D33.1(A) D34.1(A) D35.1(A) D36.1(A) D37.1(A) D38.1(A) DS1.2(K) DS2.2(K) DS3.2(K) DS4.2(K) DS5.2(K) MicroUSB-DIP1.0 MicroUSB-DIP1.5(GND) P3.4 P6.4 P14.1 P14.2 P14.3 P14.4 P19.1 P19.2 P19.3 P19.4 P24.1 P24.2 P28.4 P30.5 P30.6 Q2.2(E) R80.1 SD1.6(VSS) SD1.10(GROUND) SD1.11(GROUND) SD1.12(GROUND) SD1.13(GROUND) U6.2(GND) U6.8(STB) U6.9(EP) U8.1(GND)
VBUS: MicroUSB-DIP1.1(VCC)
VCC_3V3: C52.2 C75.2 P3.1 R28.2 R30.2 SD1.4(VDD) U6.5(VIO) U8.4(V3) U8.16(VCC)  [project net +3.3V]
VCC_5V_M: P15.1 P15.2 P15.3 P15.4 P20.1 P20.2 P20.3 P20.4 P25.1 P25.2 R27.2
VCC_5V_S: C53.1 LS1.1 P6.1 P28.1 P30.1 R26.2 U6.3(VCC)
VCC_PW: R1.2
CAN1_RX_D0: U6.4(RXD) ; port CAN1.RX
CAN1_TX_D1: U6.1(TXD) ; port CAN1.TX
PA4: D35.2(K) R76.1 R80.2 ; port ADC1_IN13(PC3)
PC13: R29.2 ; port LED_STATE(PC13)
PH6: R84.2 ; port TIM12_CH1(PH6)
SD_EXIT_E15: R53.1 ; port SD.EXIT  [project net PE15]
SDIO_CK_C12: SD1.5(CLK/SCLK) ; port SD.CK  [project net PC12]
SDIO_CMD_D2: SD1.3(CMD/DI) ; port SD.CMD  [project net PD2]
SDIO_D0_C8: SD1.7(DAT0/DO) ; port SD.D0  [project net PC8]
SDIO_D1_C9: SD1.8(DAT1) ; port SD.D1  [project net PC9]
SDIO_D2_C10: SD1.1(DAT2) ; port SD.D2  [project net PC10]
SDIO_D3_C11: SD1.2(CD/DAT3/CS) ; port SD.D3  [project net PC11]
SPI2_MISO_B14: D37.2(K) P30.3 ; port SPI2.MISO  [project net PB14]
SPI2_MOSI_B15: D38.2(K) P30.2 ; port SPI2.MOSI  [project net PB15]
SPI2_SCK_B13: D36.2(K) P30.4 ; port SPI2.SCK  [project net PB13]
SWCL_A14: R34.1 ; port SWD.CLK  [project net PA14]
SWIO_A13: R32.1 ; port SWD.IO  [project net PA13]
TIM1CH1_E9: D28.2(K) R66.1 ; port TIM1.CH1  [project net PE9]
TIM1CH2_E11: D27.2(K) R67.1 ; port TIM1.CH2  [project net PE11]
TIM1CH3_E13: D26.2(K) R68.1 ; port TIM1.CH3  [project net PE13]
TIM1CH4_E14: D25.2(K) R69.1 ; port TIM1.CH4  [project net PE14]
TIM8CH1_C6: D32.2(K) R70.1 ; port TIM8.CH1  [project net PC6]
TIM8CH2_I6: D31.2(K) R71.1 ; port TIM8.CH2  [project net PI6]
TIM8CH3_I7: D30.2(K) R72.1 ; port TIM8.CH3  [project net PI7]
TIM8CH4_I2: D29.2(K) R73.1 ; port TIM8.CH4  [project net PI2]
TIM9CH1_E5: D34.2(K) R74.1 ; port TIM9.CH1  [project net PE5]
TIM9CH2_E6: D33.2(K) R75.1 ; port TIM9.CH2  [project net PE6]
USART1_RX_A10: P34.1 ; port USART1.RX  [project net PA10]
USART1_TX_A9: P34.3 ; port USART1.TX  [project net PA9]
NetC54_1: C54.1 P6.2 R40.1
NetC55_2: C55.2 P6.3 R45.1
NetC76_2: C76.2 U8.7(XI) X3.1(OSC1)
NetC77_2: C77.2 U8.8(XO) X3.2(OSC2)
NetD8_2: D8.2(K) P3.3 R34.2
NetD10_2: D10.2(K) P3.2 R32.2
NetDS1_1: DS1.1(A) R1.1
NetDS2_1: DS2.1(A) R26.1
NetDS3_1: DS3.1(A) R27.1
NetDS4_1: DS4.1(A) R28.1
NetDS5_1: DS5.1(A) R29.1
NetLS1_2: LS1.2 Q2.3(C)
NetMicroUSB-DIP1_2: MicroUSB-DIP1.2(D-) U8.6(UD-)
NetMicroUSB-DIP1_3: MicroUSB-DIP1.3(D+) U8.5(UD+)
NetP17_1: P17.1 R66.2
NetP17_2: P17.2 R67.2
NetP17_3: P17.3 R68.2
NetP17_4: P17.4 R69.2
NetP22_1: P22.1 R70.2
NetP22_2: P22.2 R71.2
NetP22_3: P22.3 R72.2
NetP22_4: P22.4 R73.2
NetP26_1: P26.1 R74.2
NetP26_2: P26.2 R75.2
NetP28_2: P28.2 P28.3 R76.2
NetP34_2: P34.2 U8.2(TXD)
NetP34_4: P34.4 U8.3(RXD)
NetQ2_1: Q2.1(B) R84.1
NetR30_1: R30.1 R53.2 SD1.9(Cd)
NetR40_2: R40.2 R41.2 U6.7(CANH)
NetR41_1: R41.1 R45.2 U6.6(CANL)

Not connected (* = marked no-connect by the designer): MicroUSB-DIP1 4(ID); U8 9(CTS#) 10(DSR#) 11(RI#) 12(DCD#) 13(TDR#) 14(RTS#) 15(R232)

### Notes on the sheet
- USB_TTL
- (near DS1) LED
- SDCard
- SWD
- PWM
- ADC in
- SPI
- CAN Bus
- SPEAKER

### Library data of the parts
C52-C55 = CAP
D8 D10 D25-D38 = D: High Conductance Fast Diode; Published: 8-Jun-2000; LatestRevisionDate: 17-Jul-2002; LatestRevisionNote: Re-released for DXP Platform.; DatasheetVersion: 1997; PackageReference: DO-35; Publisher: Altium Limited; PackageDescription: Diode, Axial; Body 3.8 x 1.9 mm (LxDia. max), Lead Dia. 0.53 mm (max); Code_JEDEC: DO-204-AH; ComponentLink1Description: Manufacturer Link; ComponentLink1URL: http://www.fairchildsemi.com/; ComponentLink2Description: Datasheet; ComponentLink2URL: http://www.fairchildsemi.com/ds/1N%2F1N4148.pdf
LS1 = Speaker: Loudspeaker; Published: 24-Mar-1999; LatestRevisionDate: 17-Jul-2002; LatestRevisionNote: Re-released for DXP Platform.; PackageReference: PIN2; Publisher: Altium Limited
P3 P6 P14 P15 P17 P19 P20 P22 P28 = Header 4: Header, 4-Pin; LatestRevisionDate: 17-Jul-2002; LatestRevisionNote: Re-released for DXP Platform.; Publisher: Altium Limited
P24-P26 = Header 2: Header, 2-Pin; LatestRevisionDate: 17-Jul-2002; LatestRevisionNote: Re-released for DXP Platform.; Publisher: Altium Limited
P30 = Header 6: Header, 6-Pin; LatestRevisionDate: 17-Jul-2002; LatestRevisionNote: Re-released for DXP Platform.; Publisher: Altium Limited
P34 = Header 2X2: Header, 2-Pin, Dual row; LatestRevisionDate: 17-Jul-2002; LatestRevisionNote: Re-released for DXP Platform.; Publisher: Altium Limited
Q2 = NPN  SOT: NPN Bipolar Transistor; Published: 8-Jun-2000; LatestRevisionDate: 17-Jul-2002; LatestRevisionNote: Re-released for DXP Platform.; PackageReference: TO-226-AA; Publisher: Altium Limited; PackageDescription: TO, Flat Index; 3 In-Line, Axial Leads; Body Dia. 4.8mm; Leads 0.55 x 0.51 mm (max); Code_JEDEC: TO-226-AA
R1 R26-R30 R32 R34 R40 R41 R45 R53 R66-R76 R80 R84 = RES2: Resistor; Published: 8-Jun-2000; LatestRevisionDate: 17-Jul-2002; LatestRevisionNote: Re-released for DXP Platform.; PackageReference: AXIAL-0.3; Publisher: Altium Limited; PackageDescription: Axial Device, Thru-Hole; 2 Leads; 0.3 in Pin Spacing
SD1 = SDCARD-M: TF卡槽
X3 = YX

## Sheet 5.UnitConnector.SchDoc
size A4; DocumentNumber: 6; SheetNumber: 6; SheetTotal: 6
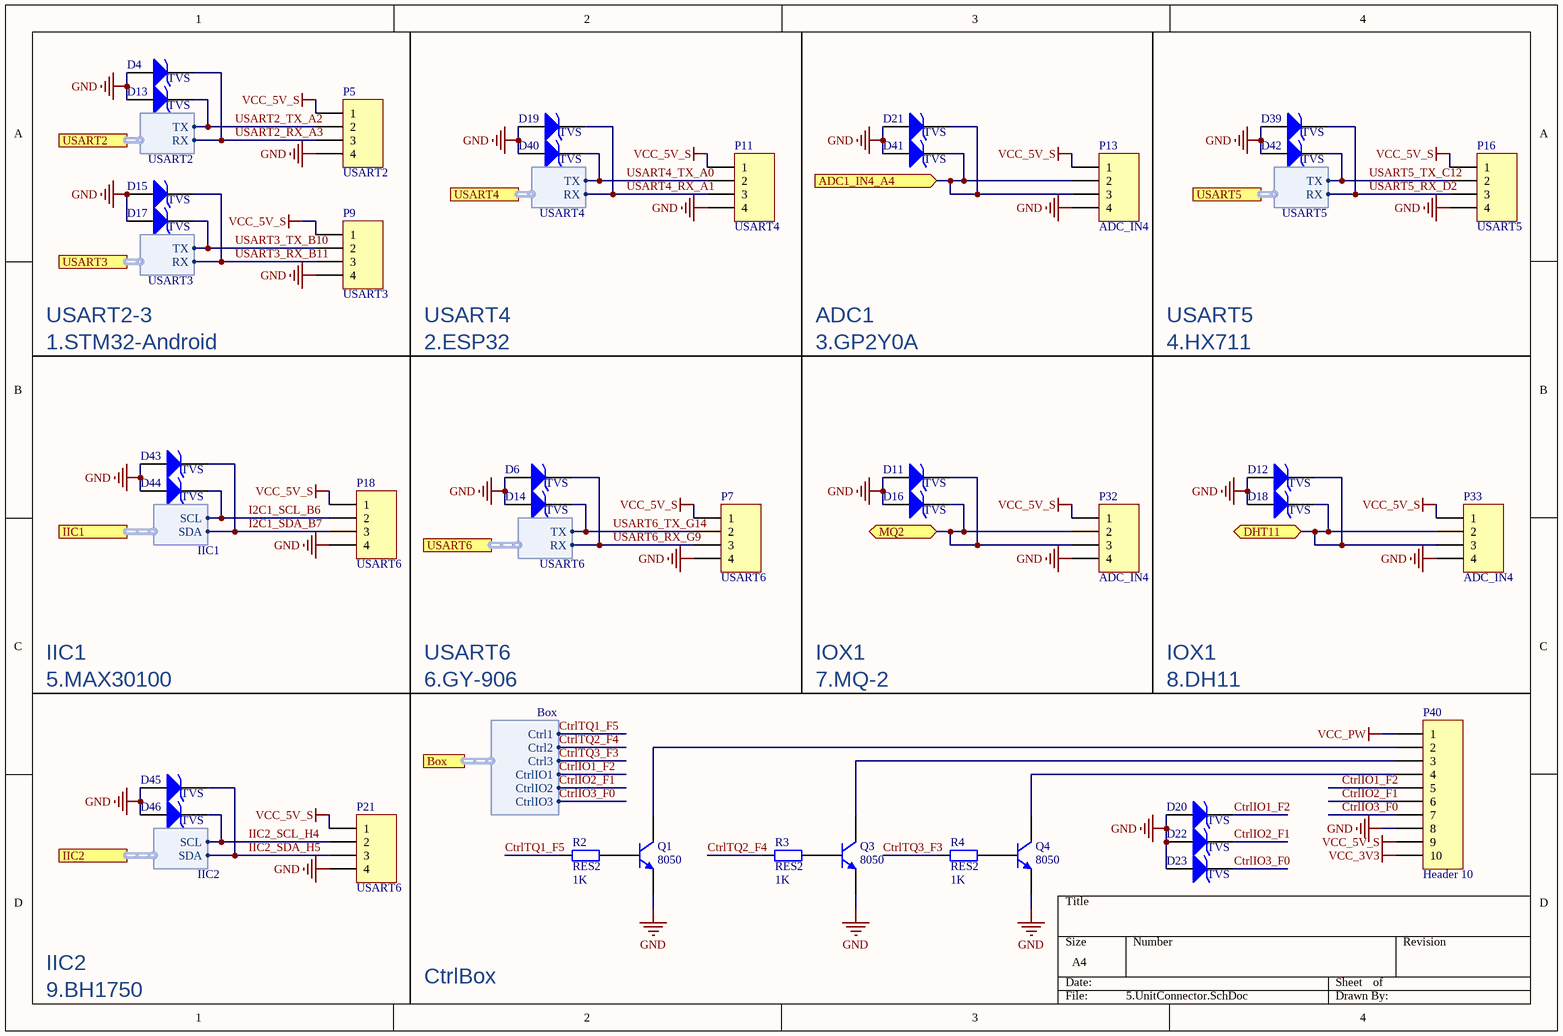
[diagram p5: 5.UnitConnector.SchDoc]

### Parts
D4  TVS  [SOD-523]
D6  TVS  [SOD-523]
D11  TVS  [SOD-523]
D12  TVS  [SOD-523]
D13  TVS  [SOD-523]
D14  TVS  [SOD-523]
D15  TVS  [SOD-523]
D16  TVS  [SOD-523]
D17  TVS  [SOD-523]
D18  TVS  [SOD-523]
D19  TVS  [SOD-523]
D20  TVS  [SOD-523]
D21  TVS  [SOD-523]
D22  TVS  [SOD-523]
D23  TVS  [SOD-523]
D39  TVS  [SOD-523]
D40  TVS  [SOD-523]
D41  TVS  [SOD-523]
D42  TVS  [SOD-523]
D43  TVS  [SOD-523]
D44  TVS  [SOD-523]
D45  TVS  [SOD-523]
D46  TVS  [SOD-523]
P5  USART2  [KF2EDGK-2.54-WI-4P]
P7  USART6  [KF2EDGK-2.54-WI-4P]
P9  USART3  [KF2EDGK-2.54-WI-4P]
P11  USART4  [KF2EDGK-2.54-WI-4P]
P13  ADC_IN4  [KF2EDGK-2.54-WI-4P]
P16  USART5  [KF2EDGK-2.54-WI-4P]
P18  USART6  [KF2EDGK-2.54-WI-4P]
P21  USART6  [KF2EDGK-2.54-WI-4P]
P32  ADC_IN4  [KF2EDGK-2.54-WI-4P]
P33  ADC_IN4  [KF2EDGK-2.54-WI-4P]
P40  Header 10  [KF2EDGK-2.54-WI-10P]
Q1  8050  [SOT23-3L]
Q3  8050  [SOT23-3L]
Q4  8050  [SOT23-3L]
R2  RES2  value 1K  [R 0805_L]
R3  RES2  value 1K  [R 0805_L]
R4  RES2  value 1K  [R 0805_L]

### Ports
ADC1_IN4_A4 (in), Box (harness Box), DHT11 (bidir), IIC1 (harness IIC1), IIC2 (harness IIC2), MQ2 (bidir), USART2 (harness USART2), USART3 (harness USART3), USART4 (harness USART4), USART5 (harness USART5), USART6 (harness USART6)

### Harnesses
USART2: TX, RX
USART3: RX, TX
USART6: TX, RX
USART4: TX, RX
USART5: TX, RX
IIC1: SCL, SDA
IIC2: SCL, SDA
Box: Ctrl1, Ctrl2, Ctrl3, CtrlIO1, CtrlIO2, CtrlIO3

### Nets
GND: D4.1(A) D6.1(A) D11.1(A) D12.1(A) D13.1(A) D14.1(A) D15.1(A) D16.1(A) D17.1(A) D18.1(A) D19.1(A) D20.1(A) D21.1(A) D22.1(A) D23.1(A) D39.1(A) D40.1(A) D41.1(A) D42.1(A) D43.1(A) D44.1(A) D45.1(A) D46.1(A) P5.4 P7.4 P9.4 P11.4 P13.4 P16.4 P18.4 P21.4 P32.4 P33.4 P40.8 Q1.2(E) Q3.2(E) Q4.2(E)
VCC_3V3: P40.10  [project net +3.3V]
VCC_5V_S: P5.1 P7.1 P9.1 P11.1 P13.1 P16.1 P18.1 P21.1 P32.1 P33.1 P40.9
VCC_PW: P40.1
CtrlIO1_F2: D20.2(K) P40.5 ; port Box.CtrlIO1
CtrlIO2_F1: D22.2(K) P40.6 ; port Box.CtrlIO2
CtrlIO3_F0: D23.2(K) P40.7 ; port Box.CtrlIO3
CtrlTQ1_F5: R2.2 ; port Box.Ctrl1
CtrlTQ2_F4: R3.2 ; port Box.Ctrl2
CtrlTQ3_F3: R4.2 ; port Box.Ctrl3
I2C1_SCL_B6: D44.2(K) P18.2 ; port IIC1.SCL
I2C1_SDA_B7: D43.2(K) P18.3 ; port IIC1.SDA
IIC2_SCL_H4: D46.2(K) P21.2 ; port IIC2.SCL
IIC2_SDA_H5: D45.2(K) P21.3 ; port IIC2.SDA
PC3: D21.2(K) D41.2(K) P13.2 P13.3 ; port ADC1_IN4_A4
PC4: D12.2(K) D18.2(K) P33.2 P33.3 ; port DHT11
PC5: D11.2(K) D16.2(K) P32.2 P32.3 ; port MQ2
USART2_RX_A3: D4.2(K) P5.3 ; port USART2.RX  [project net PA3]
USART2_TX_A2: D13.2(K) P5.2 ; port USART2.TX  [project net PA2]
USART3_RX_B11: D15.2(K) P9.3 ; port USART3.RX  [project net PB11]
USART3_TX_B10: D17.2(K) P9.2 ; port USART3.TX  [project net PB10]
USART4_RX_A1: D19.2(K) P11.3 ; port USART4.RX  [project net PD2]
USART4_TX_A0: D40.2(K) P11.2 ; port USART4.TX  [project net PC12]
USART5_RX_D2: D39.2(K) P16.3 ; port USART5.RX  [project net PG9]
USART5_TX_C12: D42.2(K) P16.2 ; port USART5.TX  [project net PG14]
USART6_RX_G9: D6.2(K) P7.3 ; port USART6.RX  [project net PA1]
USART6_TX_G14: D14.2(K) P7.2 ; port USART6.TX  [project net PA0]
NetP40_2: P40.2 Q1.3(C)
NetP40_3: P40.3 Q3.3(C)
NetP40_4: P40.4 Q4.3(C)
NetQ1_1: Q1.1(B) R2.1
NetQ3_1: Q3.1(B) R3.1
NetQ4_1: Q4.1(B) R4.1

### Notes on the sheet
- 1.STM32-Android
- USART2-3
- 2.ESP32
- USART4
- 3.GP2Y0A
- ADC1
- 4.HX711
- USART5
- 5.MAX30100
- IIC1
- 6.GY-906
- USART6
- 7.MQ-2
- IOX1
- 8.DH11
- IIC2
- CtrlBox
- 9.BH1750

### Library data of the parts
D4 D6 D11-D23 D39-D46 = D: High Conductance Fast Diode; Published: 8-Jun-2000; LatestRevisionDate: 17-Jul-2002; LatestRevisionNote: Re-released for DXP Platform.; DatasheetVersion: 1997; PackageReference: DO-35; Publisher: Altium Limited; PackageDescription: Diode, Axial; Body 3.8 x 1.9 mm (LxDia. max), Lead Dia. 0.53 mm (max); Code_JEDEC: DO-204-AH; ComponentLink1Description: Manufacturer Link; ComponentLink1URL: http://www.fairchildsemi.com/; ComponentLink2Description: Datasheet; ComponentLink2URL: http://www.fairchildsemi.com/ds/1N%2F1N4148.pdf
P5 P7 P9 P11 P13 P16 P18 P21 P32 P33 = Header 4: Header, 4-Pin; LatestRevisionDate: 17-Jul-2002; LatestRevisionNote: Re-released for DXP Platform.; Publisher: Altium Limited
P40 = Header 10: Header, 10-Pin; LatestRevisionDate: 17-Jul-2002; LatestRevisionNote: Re-released for DXP Platform.; Publisher: Altium Limited
Q1 Q3 Q4 = NPN  SOT: NPN Bipolar Transistor; Published: 8-Jun-2000; LatestRevisionDate: 17-Jul-2002; LatestRevisionNote: Re-released for DXP Platform.; PackageReference: TO-226-AA; Publisher: Altium Limited; PackageDescription: TO, Flat Index; 3 In-Line, Axial Leads; Body Dia. 4.8mm; Leads 0.55 x 0.51 mm (max); Code_JEDEC: TO-226-AA
R2-R4 = RES2: Resistor; Published: 8-Jun-2000; LatestRevisionDate: 17-Jul-2002; LatestRevisionNote: Re-released for DXP Platform.; PackageReference: AXIAL-0.3; Publisher: Altium Limited; PackageDescription: Axial Device, Thru-Hole; 2 Leads; 0.3 in Pin Spacing

## Nets that join several sheets
+3.3V: 1.MCU_IOBANK (5 pins), 2.POWER (5 pins), 3.Interface1 (P39.2), 4.Interface2 (9 pins), 5.UnitConnector (P40.10)
GND: 1.MCU_IOBANK (24 pins), 2.POWER (75 pins), 3.Interface1 (8 pins), 4.Interface2 (56 pins), 5.UnitConnector (37 pins)
VBUS: 2.POWER (D5.1), 3.Interface1 (USBC1.A4 USBC1.A9 USBC1.B4 USBC1.B9), 4.Interface2 (MicroUSB-DIP1.1)
VCC_3V3_MCU: 1.MCU_IOBANK (R8.1), 2.POWER (34 pins)
VCC_3V3_O: 1.MCU_IOBANK (P37.1 P37.2 P37.3 P37.4), 2.POWER (C50.2 C51.1 U5.2)
VCC_5V_M: 1.MCU_IOBANK (P36.1 P36.2 P36.3 P36.4), 2.POWER (14 pins), 4.Interface2 (11 pins)
VCC_5V_S: 2.POWER (15 pins), 4.Interface2 (7 pins), 5.UnitConnector (11 pins)
VCC_PW: 2.POWER (11 pins), 4.Interface2 (R1.2), 5.UnitConnector (P40.1)
CAN1_RX_D0: 1.MCU_IOBANK (P27.27 U1.142), 4.Interface2 (U6.4)
CAN1_TX_D1: 1.MCU_IOBANK (R6.2), 4.Interface2 (U6.1)
CtrlIO1_F2: 1.MCU_IOBANK (P23.17 U1.18), 5.UnitConnector (D20.2 P40.5)
CtrlIO2_F1: 1.MCU_IOBANK (P23.16 U1.17), 5.UnitConnector (D22.2 P40.6)
CtrlIO3_F0: 1.MCU_IOBANK (P23.15 U1.16), 5.UnitConnector (D23.2 P40.7)
CtrlTQ1_F5: 1.MCU_IOBANK (P23.20 U1.21), 5.UnitConnector (R2.2)
CtrlTQ2_F4: 1.MCU_IOBANK (P23.19 U1.20), 5.UnitConnector (R3.2)
CtrlTQ3_F3: 1.MCU_IOBANK (P23.18 U1.19), 5.UnitConnector (R4.2)
I2C1_SCL_B6: 1.MCU_IOBANK (P27.9 U1.164), 5.UnitConnector (D44.2 P18.2)
I2C1_SDA_B7: 1.MCU_IOBANK (P27.10 U1.165), 5.UnitConnector (D43.2 P18.3)
IIC2_SCL_H4: 1.MCU_IOBANK (P23.35 U1.45), 5.UnitConnector (D46.2 P21.2)
IIC2_SDA_H5: 1.MCU_IOBANK (P23.36 U1.46), 5.UnitConnector (D45.2 P21.3)
IIC3_SCL_H7: 1.MCU_IOBANK (P29.26 U1.84), 3.Interface1 (P39.3)
IIC3_SDA_H8: 1.MCU_IOBANK (P29.27 U1.85), 3.Interface1 (P39.4)
PA0: 1.MCU_IOBANK (P23.30 U1.40), 5.UnitConnector (D14.2 P7.2)
PA1: 1.MCU_IOBANK (P23.31 U1.41), 5.UnitConnector (D6.2 P7.3)
PA2: 1.MCU_IOBANK (P23.32 U1.42), 5.UnitConnector (D13.2 P5.2)
PA3: 1.MCU_IOBANK (P23.37 U1.47), 5.UnitConnector (D4.2 P5.3)
PA4: 1.MCU_IOBANK (P23.38 U1.50), 4.Interface2 (D35.2 R76.1 R80.2)
PA9: 1.MCU_IOBANK (P31.5 U1.120), 4.Interface2 (P34.3)
PA10: 1.MCU_IOBANK (P31.4 U1.121), 4.Interface2 (P34.1)
PA11: 1.MCU_IOBANK (P31.3 U1.122), 3.Interface1 (R31.1)
PA12: 1.MCU_IOBANK (P31.2 U1.123), 3.Interface1 (R33.1)
PA13: 1.MCU_IOBANK (P31.1 U1.124), 4.Interface2 (R32.1)
PA14: 1.MCU_IOBANK (P27.34 U1.137), 4.Interface2 (R34.1)
PB10: 1.MCU_IOBANK (P29.23 U1.79), 5.UnitConnector (D17.2 P9.2)
PB11: 1.MCU_IOBANK (P29.24 U1.80), 5.UnitConnector (D15.2 P9.3)
PB13: 1.MCU_IOBANK (P31.27 U1.93), 4.Interface2 (D36.2 P30.4)
PB14: 1.MCU_IOBANK (P31.28 U1.94), 4.Interface2 (D37.2 P30.3)
PB15: 1.MCU_IOBANK (P31.25 U1.95), 4.Interface2 (D38.2 P30.2)
PC0: 1.MCU_IOBANK (P23.26 U1.32), 2.POWER (R78.1 R79.2)
PC1: 1.MCU_IOBANK (P23.27 U1.33), 2.POWER (R25.1 R77.2)
PC2: 1.MCU_IOBANK (P23.28 U1.34), 2.POWER (R23.1 R24.2)
PC3: 1.MCU_IOBANK (P23.29 U1.35), 5.UnitConnector (D21.2 D41.2 P13.2 P13.3)
PC4: 1.MCU_IOBANK (P29.2 U1.54), 5.UnitConnector (D12.2 D18.2 P33.2 P33.3)
PC5: 1.MCU_IOBANK (P29.3 U1.55), 5.UnitConnector (D11.2 D16.2 P32.2 P32.3)
PC6: 1.MCU_IOBANK (P31.10 U1.115), 4.Interface2 (D32.2 R70.1)
PC8: 1.MCU_IOBANK (P31.8 U1.117), 4.Interface2 (SD1.7)
PC9: 1.MCU_IOBANK (P31.7 U1.118), 4.Interface2 (SD1.8)
PC10: 1.MCU_IOBANK (P27.32 U1.139), 4.Interface2 (SD1.1)
PC11: 1.MCU_IOBANK (P27.29 U1.140), 4.Interface2 (SD1.2)
PC12: 1.MCU_IOBANK (P27.30 U1.141), 4.Interface2 (SD1.5), 5.UnitConnector (D40.2 P11.2)
PC13: 1.MCU_IOBANK (P23.11 U1.8), 4.Interface2 (R29.2)
PD2: 1.MCU_IOBANK (P27.25 U1.144), 4.Interface2 (SD1.3), 5.UnitConnector (D19.2 P11.3)
PE5: 1.MCU_IOBANK (P23.8 U1.4), 4.Interface2 (D34.2 R74.1)
PE6: 1.MCU_IOBANK (P23.9 U1.5), 4.Interface2 (D33.2 R75.1)
PE9: 1.MCU_IOBANK (P29.16 U1.70), 4.Interface2 (D28.2 R66.1)
PE11: 1.MCU_IOBANK (P29.18 U1.74), 4.Interface2 (D27.2 R67.1)
PE13: 1.MCU_IOBANK (P29.20 U1.76), 4.Interface2 (D26.2 R68.1)
PE14: 1.MCU_IOBANK (P29.21 U1.77), 4.Interface2 (D25.2 R69.1)
PE15: 1.MCU_IOBANK (P29.22 U1.78), 4.Interface2 (R53.1)
PG9: 1.MCU_IOBANK (P27.19 U1.152), 5.UnitConnector (D39.2 P16.3)
PG14: 1.MCU_IOBANK (P27.16 U1.157), 5.UnitConnector (D42.2 P16.2)
PH6: 1.MCU_IOBANK (P29.25 U1.83), 4.Interface2 (R84.2)
PI2: 1.MCU_IOBANK (P27.36 U1.133), 4.Interface2 (D29.2 R73.1)
PI6: 1.MCU_IOBANK (P27.1 U1.175), 4.Interface2 (D31.2 R71.1)
PI7: 1.MCU_IOBANK (P27.2 U1.176), 4.Interface2 (D30.2 R72.1)